# Altium schematic sheet Super_IO.SchDoc
size 420 x 297 mm
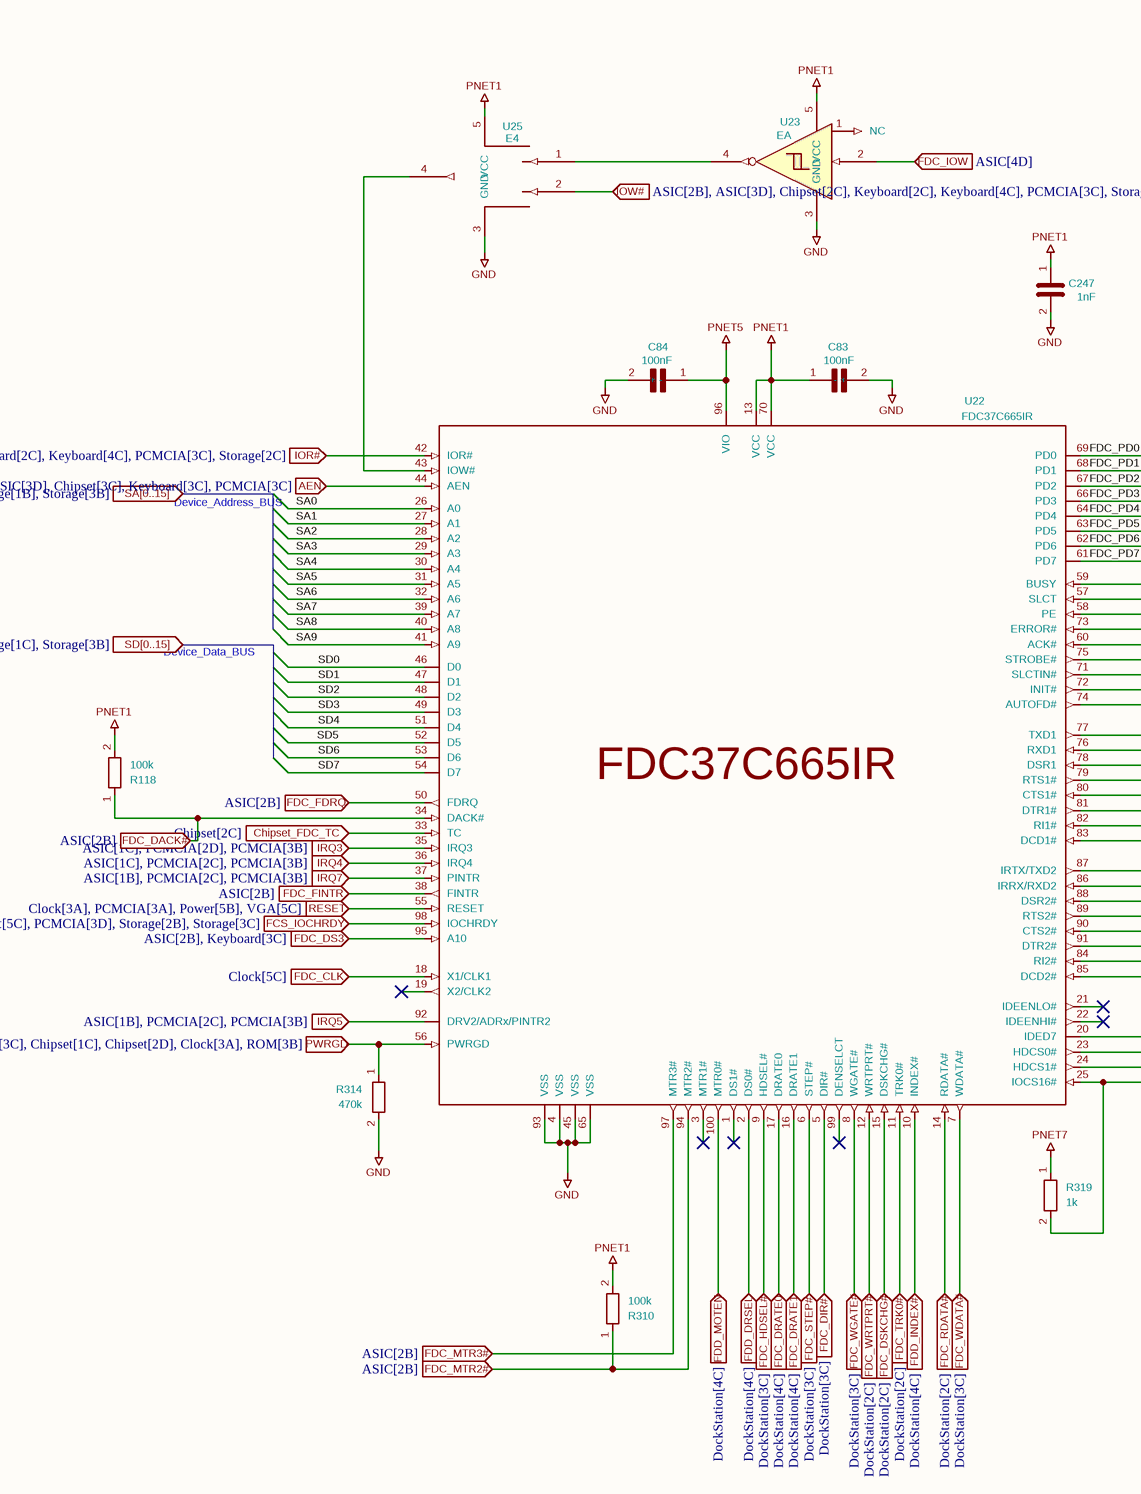
[diagram p0: Super_IO.SchDoc, left]
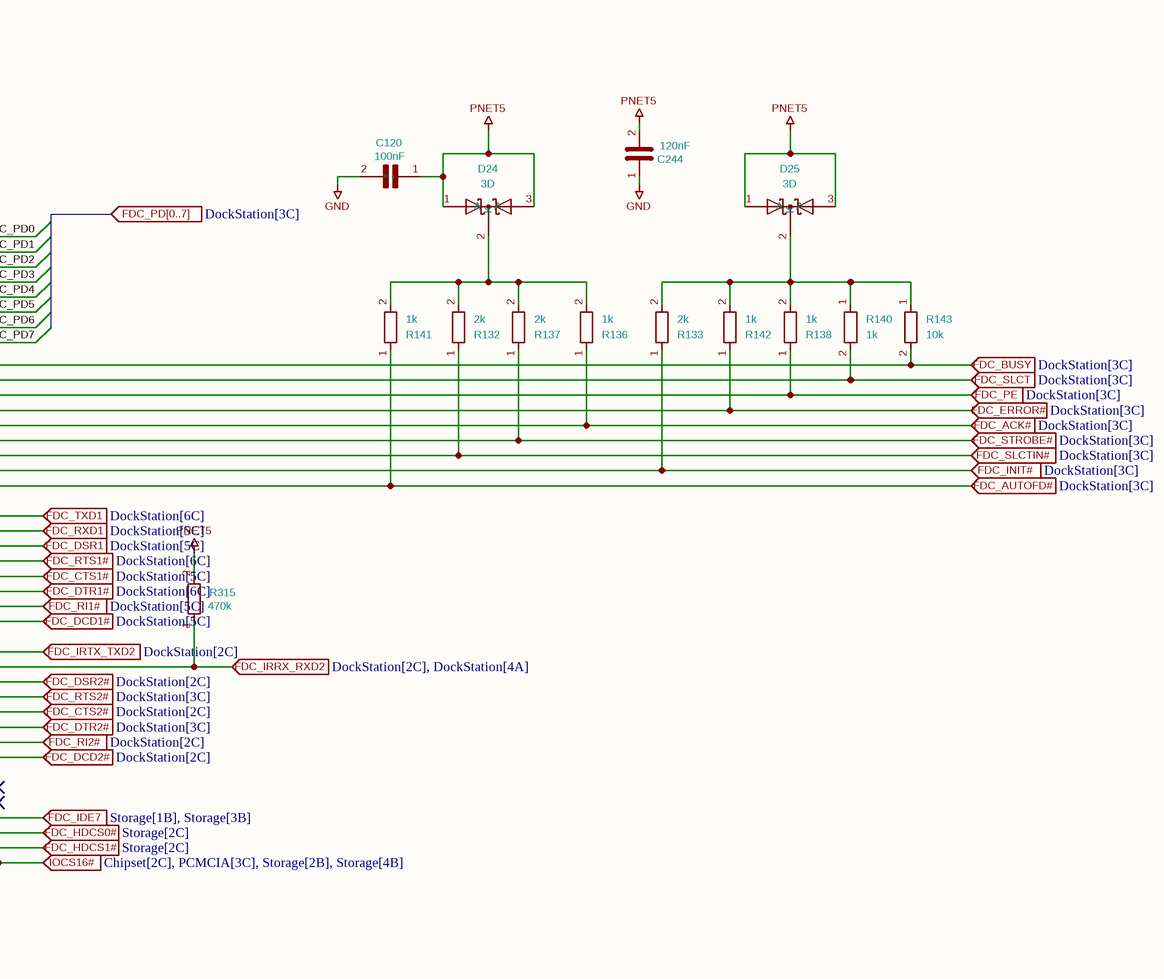
[diagram p1: Super_IO.SchDoc, right]

## Parts
C83  100nF  [C_0402_1005Metric]
C84  100nF  [C_0402_1005Metric]
C120  100nF  [C_0402_1005Metric]
C244  120nF  [C_0402_1005Metric]
C247  1nF  [C_0402_1005Metric]
D24  3D  [3D]
D25  3D  [3D]
R118  100k  [R_0402_1005Metric]
R132  2k  [R_0402_1005Metric]
R133  2k  [R_0402_1005Metric]
R136  1k  [R_0402_1005Metric]
R137  2k  [R_0402_1005Metric]
R138  1k  [R_0402_1005Metric]
R140  1k  [R_0402_1005Metric]
R141  1k  [R_0402_1005Metric]
R142  1k  [R_0402_1005Metric]
R143  10k  [R_0402_1005Metric]
R310  100k  [R_0402_1005Metric]
R314  470k  [R_0402_1005Metric]
R315  470k  [R_0402_1005Metric]
R319  1k  [R_0402_1005Metric]
U22  FDC37C665IR  [FDC]
U23  EA  [SOT-353]
U25  E4  [SOT-353]

## Ports
AEN (in, see ASIC[2B], ASIC[3D], Chipset[3C], Keyboard[3C], PCMCIA[3C]), Chipset_FDC_TC (in, see Chipset[2C]), FCS_IOCHRDY (in, see Chipset[5C], PCMCIA[3D], Storage[2B], Storage[3C]), FDC_ACK# (in, see DockStation[3C]), FDC_AUTOFD# (in, see DockStation[3C]), FDC_BUSY (in, see DockStation[3C]), FDC_CLK (in, see Clock[5C]), FDC_CTS1# (in, see DockStation[5C]), FDC_CTS2# (in, see DockStation[2C]), FDC_DACK# (in, see ASIC[2B]), FDC_DCD1# (in, see DockStation[5C]), FDC_DCD2# (in, see DockStation[2C]), FDC_DIR# (in, see DockStation[3C]), FDC_DRATE0 (in, see DockStation[4C]), FDC_DRATE1 (in, see DockStation[4C]), FDC_DS3 (in, see ASIC[2B], Keyboard[3C]), FDC_DSKCHG# (in, see DockStation[2C]), FDC_DSR1 (in, see DockStation[5C]), FDC_DSR2# (in, see DockStation[2C]), FDC_DTR1# (in, see DockStation[6C]), FDC_DTR2# (in, see DockStation[3C]), FDC_ERROR# (in, see DockStation[3C]), FDC_FDRQ (in, see ASIC[2B]), FDC_FINTR (in, see ASIC[2B]), FDC_HDCS0# (in, see Storage[2C]), FDC_HDCS1# (in, see Storage[2C]), FDC_HDSEL# (in, see DockStation[3C]), FDC_IDE7 (in, see Storage[1B], Storage[3B]), FDC_INIT# (in, see DockStation[3C]), FDC_IOW (in, see ASIC[4D]), FDC_IRRX_RXD2 (in, see DockStation[2C], DockStation[4A]), FDC_IRTX_TXD2 (in, see DockStation[2C]), FDC_MTR2# (in, see ASIC[2B]), FDC_MTR3# (in, see ASIC[2B]), FDC_PD[0..7] (in, see DockStation[3C]), FDC_PE (in, see DockStation[3C]), FDC_RDATA# (in, see DockStation[2C]), FDC_RI1# (in, see DockStation[5C]), FDC_RI2# (in, see DockStation[2C]), FDC_RTS1# (in, see DockStation[6C]), FDC_RTS2# (in, see DockStation[3C]), FDC_RXD1 (in, see DockStation[5C]), FDC_SLCT (in, see DockStation[3C]), FDC_SLCTIN# (in, see DockStation[3C]), FDC_STEP# (in, see DockStation[3C]), FDC_STROBE# (in, see DockStation[3C]), FDC_TRK0# (in, see DockStation[2C]), FDC_TXD1 (in, see DockStation[6C]), FDC_WDATA# (in, see DockStation[3C]), FDC_WGATE# (in, see DockStation[3C]), FDC_WRTPRT# (in, see DockStation[2C]), FDD_DRSEL (in, see DockStation[4C]), FDD_INDEX# (in, see DockStation[4C]), FDD_MOTEN (in, see DockStation[4C]), IOCS16# (in, see Chipset[2C], PCMCIA[3C], Storage[2B], Storage[4B]), IOR# (in, see ASIC[2B], ASIC[3D], Audio[3C], Audio[4C], Chipset[2C], Keyboard[2C], Keyboard[4C], PCMCIA[3C], Storage[2C]), IOW# (in, see ASIC[2B], ASIC[3D], Chipset[2C], Keyboard[2C], Keyboard[4C], PCMCIA[3C], Storage[2C]), IRQ3 (in, see ASIC[1C], PCMCIA[2D], PCMCIA[3B]), IRQ4 (in, see ASIC[1C], PCMCIA[2C], PCMCIA[3B]), IRQ5 (in, see ASIC[1B], PCMCIA[2C], PCMCIA[3B]), IRQ7 (in, see ASIC[1B], PCMCIA[2C], PCMCIA[3B]), PWRGD (in, see ASIC[2B], ASIC[3B], ASIC[3C], Chipset[1C], Chipset[2D], Clock[3A], ROM[3B]), RESET (in, see Clock[3A], PCMCIA[3A], Power[5B], VGA[5C]), SA[0..15] (in, see ASIC[1B], ASIC[3D], Audio[4B], Chipset[2D], Chipset[6B], Keyboard[1C], PCMCIA[2B], ROM[1B], ROM[3B], Storage[1B], Storage[3B]), SD[0..15] (in, see ASIC[1B], ASIC[3C], Audio[3B], Chipset[2B], Keyboard[1C], PCMCIA[2C], ROM[3B], ROM[5C], Storage[1B], Storage[1C], Storage[3B])

## Nets
GND: C83.2(-) C84.2(-) C120.2(-) C244.1 C247.2 R314.2 U22.4(VSS) U22.45(VSS) U22.65(VSS) U22.93(VSS) U23.3(GND) U25.3(GND)
PNET1: C83.1(+) C247.1 R118.2 R310.2 U22.13(VCC) U22.70(VCC) U23.5(VCC) U25.5(VCC)
PNET5: C84.1(+) C120.1(+) C244.2 D24.1(A) D24.3(A) D25.1(A) D25.3(A) R315.2 U22.96(VIO)
PNET7: R319.1
AEN: U22.44(AEN) ; port AEN
Chipset_FDC_TC: U22.33(TC) ; port Chipset_FDC_TC
FCS_IOCHRDY: U22.98(IOCHRDY) ; port FCS_IOCHRDY
FDC_ACK#: R136.1 U22.60(ACK#) ; port FDC_ACK#
FDC_AUTOFD#: R141.1 U22.74(AUTOFD#) ; port FDC_AUTOFD#
FDC_BUSY: R143.2 U22.59(BUSY) ; port FDC_BUSY
FDC_CLK: U22.18(X1/CLK1) ; port FDC_CLK
FDC_CTS1#: U22.80(CTS1#) ; port FDC_CTS1#
FDC_CTS2#: U22.90(CTS2#) ; port FDC_CTS2#
FDC_DACK#: R118.1 U22.34(DACK#) ; port FDC_DACK#
FDC_DCD1#: U22.83(DCD1#) ; port FDC_DCD1#
FDC_DCD2#: U22.85(DCD2#) ; port FDC_DCD2#
FDC_DIR#: U22.5(DIR#) ; port FDC_DIR#
FDC_DRATE0: U22.17(DRATE0) ; port FDC_DRATE0
FDC_DRATE1: U22.16(DRATE1) ; port FDC_DRATE1
FDC_DS3: U22.95(A10) ; port FDC_DS3
FDC_DSKCHG#: U22.15(DSKCHG#) ; port FDC_DSKCHG#
FDC_DSR1: U22.78(DSR1) ; port FDC_DSR1
FDC_DSR2#: U22.88(DSR2#) ; port FDC_DSR2#
FDC_DTR1#: U22.81(DTR1#) ; port FDC_DTR1#
FDC_DTR2#: U22.91(DTR2#) ; port FDC_DTR2#
FDC_ERROR#: R142.1 U22.73(ERROR#) ; port FDC_ERROR#
FDC_FDRQ: U22.50(FDRQ) ; port FDC_FDRQ
FDC_FINTR: U22.38(FINTR) ; port FDC_FINTR
FDC_HDCS0#: U22.23(HDCS0#) ; port FDC_HDCS0#
FDC_HDCS1#: U22.24(HDCS1#) ; port FDC_HDCS1#
FDC_HDSEL#: U22.9(HDSEL#) ; port FDC_HDSEL#
FDC_IDE7: U22.20(IDED7) ; port FDC_IDE7
FDC_INIT#: R133.1 U22.72(INIT#) ; port FDC_INIT#
FDC_IOW: U23.2 ; port FDC_IOW
FDC_IRRX_RXD2: R315.1 U22.86(IRRX/RXD2) ; port FDC_IRRX_RXD2
FDC_IRTX_TXD2: U22.87(IRTX/TXD2) ; port FDC_IRTX_TXD2
FDC_MTR2#: R310.1 U22.94(MTR2#) ; port FDC_MTR2#
FDC_MTR3#: U22.97(MTR3#) ; port FDC_MTR3#
FDC_PD0: U22.69(PD0)
FDC_PD1: U22.68(PD1)
FDC_PD2: U22.67(PD2)
FDC_PD3: U22.66(PD3)
FDC_PD4: U22.64(PD4)
FDC_PD5: U22.63(PD5)
FDC_PD6: U22.62(PD6)
FDC_PD7: U22.61(PD7)
FDC_PE: R138.1 U22.58(PE) ; port FDC_PE
FDC_RDATA#: U22.14(RDATA#) ; port FDC_RDATA#
FDC_RI1#: U22.82(RI1#) ; port FDC_RI1#
FDC_RI2#: U22.84(RI2#) ; port FDC_RI2#
FDC_RTS1#: U22.79(RTS1#) ; port FDC_RTS1#
FDC_RTS2#: U22.89(RTS2#) ; port FDC_RTS2#
FDC_RXD1: U22.76(RXD1) ; port FDC_RXD1
FDC_SLCT: R140.2 U22.57(SLCT) ; port FDC_SLCT
FDC_SLCTIN#: R132.1 U22.71(SLCTIN#) ; port FDC_SLCTIN#
FDC_STEP#: U22.6(STEP#) ; port FDC_STEP#
FDC_STROBE#: R137.1 U22.75(STROBE#) ; port FDC_STROBE#
FDC_TRK0#: U22.11(TRK0#) ; port FDC_TRK0#
FDC_TXD1: U22.77(TXD1) ; port FDC_TXD1
FDC_WDATA#: U22.7(WDATA#) ; port FDC_WDATA#
FDC_WGATE#: U22.8(WGATE#) ; port FDC_WGATE#
FDC_WRTPRT#: U22.12(WRTPRT#) ; port FDC_WRTPRT#
FDD_DRSEL: U22.2(DS0#) ; port FDD_DRSEL
FDD_INDEX#: U22.10(INDEX#) ; port FDD_INDEX#
FDD_MOTEN: U22.100(MTR0#) ; port FDD_MOTEN
IOCS16#: R319.2 U22.25(IOCS16#) ; port IOCS16#
IOR#: U22.42(IOR#) ; port IOR#
IOW#: U25.2 ; port IOW#
IRQ3: U22.35(IRQ3) ; port IRQ3
IRQ4: U22.36(IRQ4) ; port IRQ4
IRQ5: U22.92(DRV2/ADRx/PINTR2) ; port IRQ5
IRQ7: U22.37(PINTR) ; port IRQ7
PWRGD: R314.1 U22.56(PWRGD) ; port PWRGD
RESET: U22.55(RESET) ; port RESET
SA0: U22.26(A0)
SA1: U22.27(A1)
SA2: U22.28(A2)
SA3: U22.29(A3)
SA4: U22.30(A4)
SA5: U22.31(A5)
SA6: U22.32(A6)
SA7: U22.39(A7)
SA8: U22.40(A8)
SA9: U22.41(A9)
SD0: U22.46(D0)
SD1: U22.47(D1)
SD2: U22.48(D2)
SD3: U22.49(D3)
SD4: U22.51(D4)
SD5: U22.52(D5)
SD6: U22.53(D6)
SD7: U22.54(D7)
NetD24_2: D24.2(K) R132.2 R136.2 R137.2 R141.2
NetD25_2: D25.2(K) R133.2 R138.2 R140.1 R142.2 R143.1
NetU22_43: U22.43(IOW#) U25.4
NetU23_4: U23.4 U25.1

Not connected (* = marked no-connect by the designer): U22 1(DS1#)* 3(MTR1#)* 19(X2/CLK2)* 21(IDEENLO#)* 22(IDEENHI#)* 99(DENSELCT)*; U23 1(NC)

## Notes on the sheet
- Device_Address_BUS
- Device_Data_BUS
- 1
- 2
- 3
- 4
- 5
- 6
- 7
- 8
- A
- B
- C
- D
- E
- Title: PC110
- File: Super_IO.kicad_sch
- Sheet: /
- Recreated by: Ahmad Byagowi
- F
- KiCad E.D.A.  kicad (5.1.4)-1
- Size: A3
- Date:
- Rev:
- Id: 1/1

## Library data of the parts
C83 C84 C120 C244 C247 = C: Footprint: Capacitor_SMD:C_0402_1005Metric
  C83 C84 C120: Value: 100nF
  C244: Value: 120nF
  C247: Value: 1nF
D24 D25 = D_Schottky_Dual_CommonCathode_AKA: Value: 3D; Footprint: PC110:3D
R118 R132 R133 R136-R138 R140-R143 R310 R314 R315 R319 = R
  R118: Value: 100k; Footprint: PCM_Resistor_SMD_AKL:R_0402_1005Metric
  R132 R133 R137: Value: 2k; Footprint: PCM_Resistor_SMD_AKL:R_0402_1005Metric
  R136 R138 R140-R142 R319: Value: 1k; Footprint: PCM_Resistor_SMD_AKL:R_0402_1005Metric
  R143: Value: 10k; Footprint: PCM_Resistor_SMD_AKL:R_0402_1005Metric
  R310: Value: 100k; Footprint: Resistor_SMD:R_0402_1005Metric
  R314: Value: 470k; Footprint: PCM_Resistor_SMD_AKL:R_0402_1005Metric
  R315: Value: 470k; Footprint: Resistor_SMD:R_0402_1005Metric
U23 = 74AHC1G14: Value: EA; Footprint: PC110:SOT-353
U25 = 74AHC1G32: Value: E4; Footprint: PC110:SOT-353
U22 = FDC37C665IR: Value: FDC37C665IR; Footprint: PC110:FDC